# Altium schematic sheet 06 MIMXRT1170 PART2.SchDoc
size A2; VersionControl_RevNumber: DNP; IsUserConfigurable: DNP; OrgAddr3: Sunrise FL 33323; OrgName: Pixels on Target; Page Create Date: March  8, 1995; Page Number: 5; Page Size: A2; Page Count: 14; OrgAddr2: Suite #104; RevCode: A; Doc: SCH30-00070-00; DsnPath: C:\Users\Carter Nichols\Documents\BitBucket boards (Cadence)\30-00070-00_Original\SCH30-00070-00.DSN; SchematicName: SC30-00070-00; PageName: 05-POWER IN; PageSize: A2; TopSchematic: True; Address4: United States
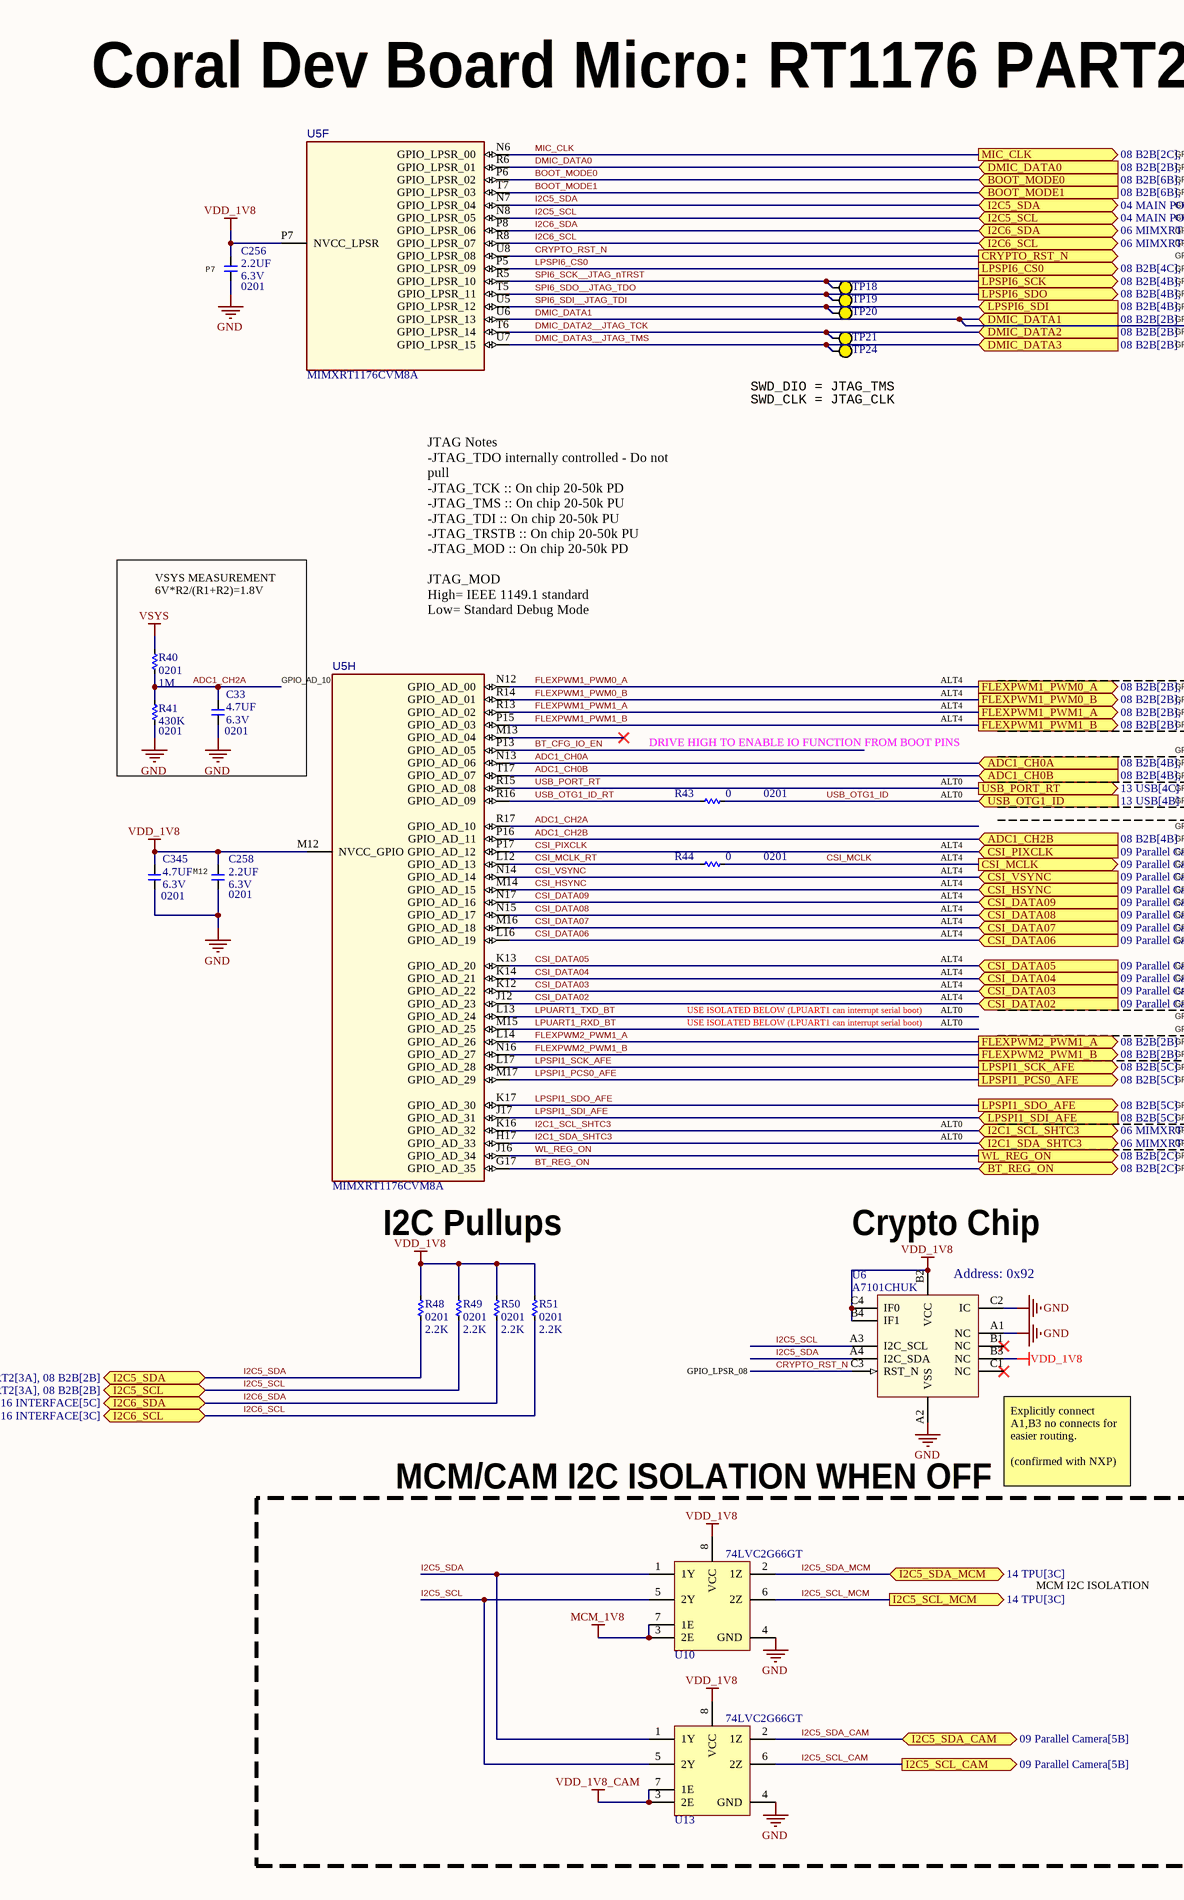
[diagram p0: 06 MIMXRT1170 PART2.SchDoc, left]
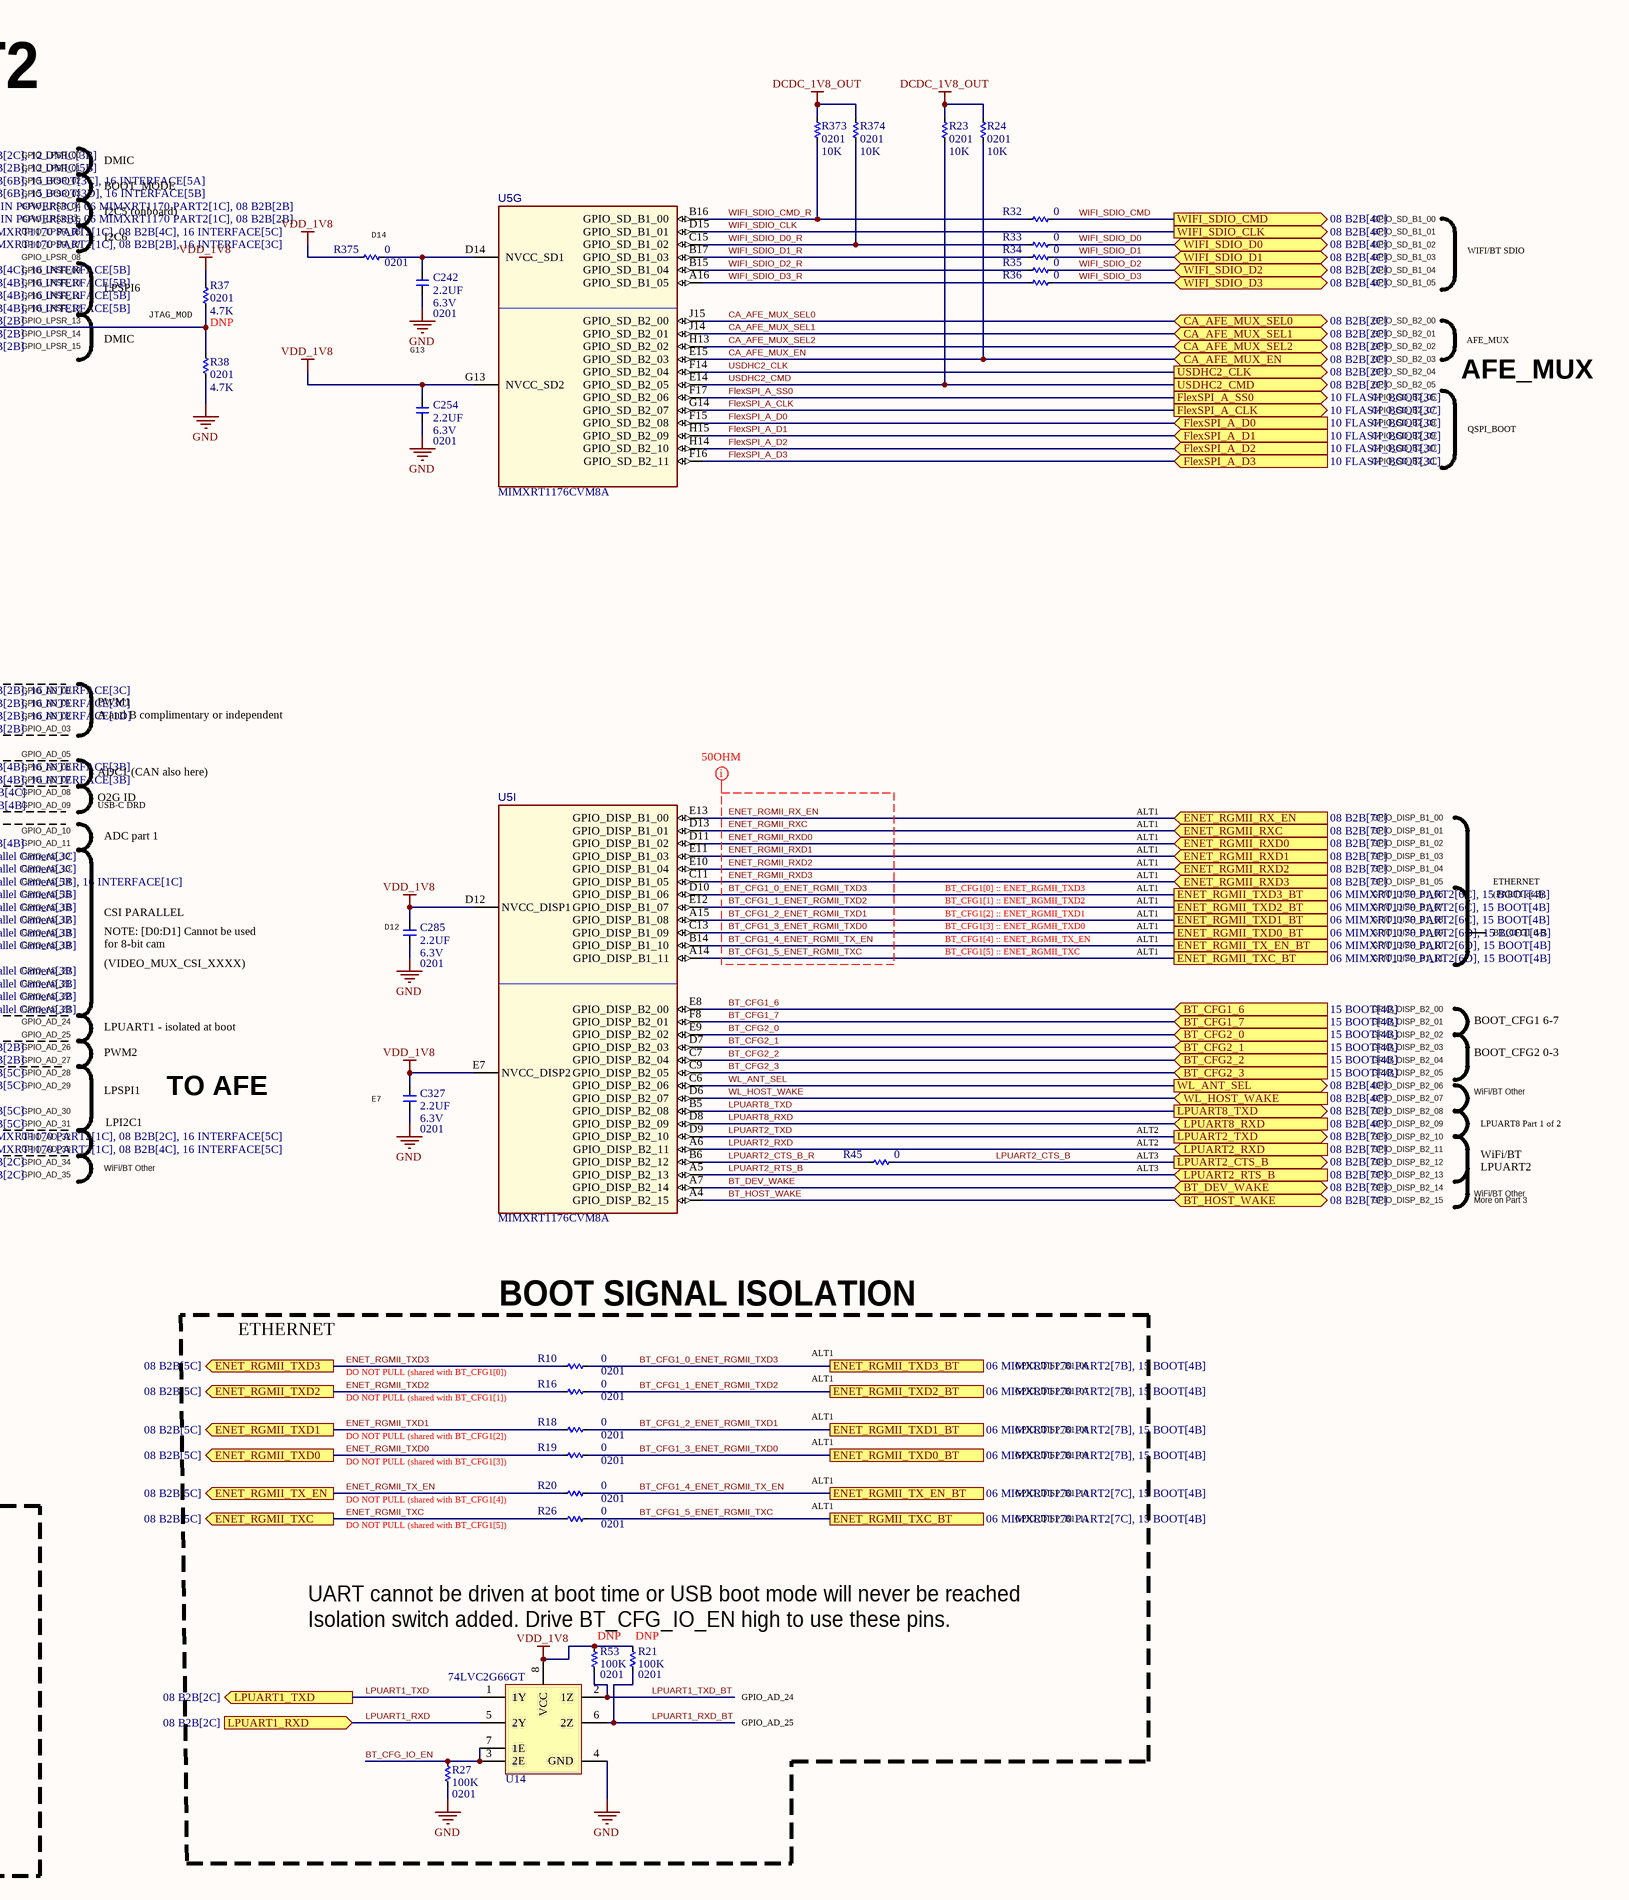
[diagram p1: 06 MIMXRT1170 PART2.SchDoc, right]

## Parts
C33  value 4.7UF  Package: 0201  Voltage: 6.3V  [C0201Y]  (hidden comment: __Template_Cap)
C242  value 2.2UF  Package: 0201  Voltage: 6.3V  [C0201_H0.39MM]  (hidden comment: __Template_Cap)
C254  value 2.2UF  Package: 0201  Voltage: 6.3V  [C0201_H0.39MM]  (hidden comment: __Template_Cap)
C256  value 2.2UF  Package: 0201  Voltage: 6.3V  [C0201_H0.39MM]  (hidden comment: __Template_Cap)
C258  value 2.2UF  Package: 0201  Voltage: 6.3V  [C0201_H0.39MM]  (hidden comment: __Template_Cap)
C285  value 2.2UF  Package: 0201  Voltage: 6.3V  [C0201_H0.39MM]  (hidden comment: __Template_Cap)
C327  value 2.2UF  Package: 0201  Voltage: 6.3V  [C0201_H0.39MM]  (hidden comment: __Template_Cap)
C345  value 4.7UF  Package: 0201  Voltage: 6.3V  [C0201Y]  (hidden comment: __Template_Cap)
R10  value 0  Package: 0201  [R0201]
R16  value 0  Package: 0201  [R0201]
R18  value 0  Package: 0201  [R0201]
R19  value 0  Package: 0201  [R0201]
R20  value 0  Package: 0201  [R0201]
R21  value 100K  Package: 0201  [R0201]
R23  value 10K  Package: 0201  [R0201]
R24  value 10K  Package: 0201  [R0201]
R26  value 0  Package: 0201  [R0201]
R27  value 100K  Package: 0201  [R0201]
R32  value 0  [R0201]
R33  value 0  [R0201]
R34  value 0  [R0201]
R35  value 0  [R0201]
R36  value 0  [R0201]
R37  value 4.7K  Package: 0201  [R0201]
R38  value 4.7K  Package: 0201  [R0201]
R40  value 1M  Package: 0201  [R0201]
R41  value 430K  Package: 0201  [R0201]
R43  value 0  Package: 0201  [R0201]
R44  value 0  Package: 0201  [R0201]
R45  value 0  [R0201]
R48  value 2.2K  Package: 0201  [R0201]
R49  value 2.2K  Package: 0201  [R0201]
R50  value 2.2K  Package: 0201  [R0201]
R51  value 2.2K  Package: 0201  [R0201]
R53  value 100K  Package: 0201  [R0201]
R373  value 10K  Package: 0201  [R0201]
R374  value 10K  Package: 0201  [R0201]
R375  value 0  Package: 0201  [R0201]
TP18  TESTPAD_30MIL  [TESTPAD_SMT_30MIL]  (value not drawn)  (no BOM)
TP19  TESTPAD_30MIL  [TESTPAD_SMT_30MIL]  (value not drawn)  (no BOM)
TP20  TESTPAD_30MIL  [TESTPAD_SMT_30MIL]  (value not drawn)  (no BOM)
TP21  TESTPAD_30MIL  [TESTPAD_SMT_30MIL]  (value not drawn)  (no BOM)
TP24  TESTPAD_30MIL  [TESTPAD_SMT_30MIL]  (value not drawn)  (no BOM)
U5  MFG P/N: MIMXRT1176CVM8A  [BGA289C80P17X17_1400X14000X152]  (hidden comment: MCU_MIMXRT1176CVM8A)  (parts F,G,H,I of 12)
U6  MFG P/N: A7101CHUK  [BGA12C50+3X4_206X202X65]  (hidden comment: SECUR_AUTH_A7101CHUK)
U10  74LVC2G66GT  [SON8_0P5_1L95x1W]
U13  74LVC2G66GT  [SON8_0P5_1L95x1W]
U14  74LVC2G66GT  [SON8_0P5_1L95x1W]

## Blocks framed on the sheet
BOOT SIGNAL ISOLATION: R10 R16 R18-R21 R26 R27 R53 U14
MCM/CAM I2C ISOLATION WHEN OFF: U10 U13

## Ports
ADC1_CH0A (in, see 08 B2B[4B], 16 INTERFACE[3B]), ADC1_CH0B (in, see 08 B2B[4B], 16 INTERFACE[3B]), ADC1_CH2B (in, see 08 B2B[4B]), BOOT_MODE0 (in, see 08 B2B[6B], 15 BOOT[3C], 16 INTERFACE[5A]), BOOT_MODE1 (in, see 08 B2B[6B], 15 BOOT[3D], 16 INTERFACE[5B]), BT_CFG1_6 (in, see 15 BOOT[4B]), BT_CFG1_7 (in, see 15 BOOT[4B]), BT_CFG2_0 (in, see 15 BOOT[4B]), BT_CFG2_1 (in, see 15 BOOT[4B]), BT_CFG2_2 (in, see 15 BOOT[4B]), BT_CFG2_3 (in, see 15 BOOT[4B]), BT_DEV_WAKE (bidir, see 08 B2B[7C]), BT_HOST_WAKE (bidir, see 08 B2B[7C]), BT_REG_ON (bidir, see 08 B2B[2C]), CA_AFE_MUX_EN (bidir, see 08 B2B[2C]), CA_AFE_MUX_SEL0 (bidir, see 08 B2B[2C]), CA_AFE_MUX_SEL1 (bidir, see 08 B2B[2C]), CA_AFE_MUX_SEL2 (bidir, see 08 B2B[2C]), CRYPTO_RST_N (out), CSI_DATA02 (in, see 09 Parallel Camera[3B]), CSI_DATA03 (in, see 09 Parallel Camera[3B]), CSI_DATA04 (in, see 09 Parallel Camera[3B]), CSI_DATA05 (in, see 09 Parallel Camera[3B]), CSI_DATA06 (in, see 09 Parallel Camera[3B]), CSI_DATA07 (in, see 09 Parallel Camera[3B]), CSI_DATA08 (in, see 09 Parallel Camera[3B]), CSI_DATA09 (in, see 09 Parallel Camera[3B]), CSI_HSYNC (in, see 09 Parallel Camera[5B]), CSI_MCLK (out, see 09 Parallel Camera[3C]), CSI_PIXCLK (in, see 09 Parallel Camera[3C]), CSI_VSYNC (in, see 09 Parallel Camera[5B], 16 INTERFACE[1C]), DMIC_DATA0 (in, see 08 B2B[2B], 12 DMIC[5B]), DMIC_DATA1 (in, see 08 B2B[2B]), DMIC_DATA2 (in, see 08 B2B[2B]), DMIC_DATA3 (in, see 08 B2B[2B]), ENET_RGMII_RX_EN (in, see 08 B2B[7C]), ENET_RGMII_RXC (in, see 08 B2B[7C]), ENET_RGMII_RXD0 (in, see 08 B2B[7C]), ENET_RGMII_RXD1 (in, see 08 B2B[7C]), ENET_RGMII_RXD2 (in, see 08 B2B[7C]), ENET_RGMII_RXD3 (in, see 08 B2B[7C]), ENET_RGMII_TX_EN (out, see 08 B2B[5C]), ENET_RGMII_TX_EN_BT (see 06 MIMXRT1170 PART2[6D], 15 BOOT[4B]), ENET_RGMII_TX_EN_BT (see 06 MIMXRT1170 PART2[7C], 15 BOOT[4B]), ENET_RGMII_TXC (out, see 08 B2B[5C]), ENET_RGMII_TXC_BT (see 06 MIMXRT1170 PART2[6D], 15 BOOT[4B]), ENET_RGMII_TXC_BT (see 06 MIMXRT1170 PART2[7C], 15 BOOT[4B]), ENET_RGMII_TXD0 (out, see 08 B2B[5C]), ENET_RGMII_TXD0_BT (see 06 MIMXRT1170 PART2[6D], 15 BOOT[4B]), ENET_RGMII_TXD0_BT (see 06 MIMXRT1170 PART2[7B], 15 BOOT[4B]), ENET_RGMII_TXD1 (out, see 08 B2B[5C]), ENET_RGMII_TXD1_BT (see 06 MIMXRT1170 PART2[6C], 15 BOOT[4B]), ENET_RGMII_TXD1_BT (see 06 MIMXRT1170 PART2[7B], 15 BOOT[4B]), ENET_RGMII_TXD2 (out, see 08 B2B[5C]), ENET_RGMII_TXD2_BT (see 06 MIMXRT1170 PART2[6C], 15 BOOT[4B]), ENET_RGMII_TXD2_BT (see 06 MIMXRT1170 PART2[7B], 15 BOOT[4B]), ENET_RGMII_TXD3 (out, see 08 B2B[5C]), ENET_RGMII_TXD3_BT (see 06 MIMXRT1170 PART2[6C], 15 BOOT[4B]), ENET_RGMII_TXD3_BT (see 06 MIMXRT1170 PART2[7B], 15 BOOT[4B]), FLEXPWM1_PWM0_A (out, see 08 B2B[2B], 16 INTERFACE[3C]), FLEXPWM1_PWM0_B (out, see 08 B2B[2B], 16 INTERFACE[3C]), FLEXPWM1_PWM1_A (out, see 08 B2B[2B], 16 INTERFACE[1D]), FLEXPWM1_PWM1_B (out, see 08 B2B[2B]), FLEXPWM2_PWM1_A (out, see 08 B2B[2B]), FLEXPWM2_PWM1_B (out, see 08 B2B[2B]), FlexSPI_A_CLK (out, see 10 FLASH_BOOT[3C]), FlexSPI_A_D0 (in, see 10 FLASH_BOOT[3C]), FlexSPI_A_D1 (in, see 10 FLASH_BOOT[3C]), FlexSPI_A_D2 (in, see 10 FLASH_BOOT[3C]), FlexSPI_A_D3 (in, see 10 FLASH_BOOT[3C]), FlexSPI_A_SS0 (out, see 10 FLASH_BOOT[3C]), I2C1_SCL_SHTC3 (bidir, see 06 MIMXRT1170 PART2[1C], 08 B2B[2C], 16 INTERFACE[5C]), I2C1_SDA_SHTC3 (bidir, see 06 MIMXRT1170 PART2[1C], 08 B2B[4C], 16 INTERFACE[5C]), I2C5_SCL (bidir, see 04 MAIN POWER[3B], 06 MIMXRT1170 PART2[1C], 08 B2B[2B]), I2C5_SCL (bidir, see 04 MAIN POWER[3B], 06 MIMXRT1170 PART2[3A], 08 B2B[2B]), I2C5_SCL_CAM (out, see 09 Parallel Camera[5B]), I2C5_SCL_MCM (out, see 14 TPU[3C]), I2C5_SDA (bidir, see 04 MAIN POWER[3C], 06 MIMXRT1170 PART2[1C], 08 B2B[2B]), I2C5_SDA (bidir, see 04 MAIN POWER[3C], 06 MIMXRT1170 PART2[3A], 08 B2B[2B]), I2C5_SDA_CAM (bidir, see 09 Parallel Camera[5B]), I2C5_SDA_MCM (bidir, see 14 TPU[3C]), I2C6_SCL (bidir, see 06 MIMXRT1170 PART2[1C], 08 B2B[2B], 16 INTERFACE[3C]), I2C6_SCL (bidir, see 06 MIMXRT1170 PART2[3A], 08 B2B[2B], 16 INTERFACE[3C]), I2C6_SDA (bidir, see 06 MIMXRT1170 PART2[1C], 08 B2B[4C], 16 INTERFACE[5C]), I2C6_SDA (bidir, see 06 MIMXRT1170 PART2[3A], 08 B2B[4C], 16 INTERFACE[5C]), LPSPI1_PCS0_AFE (out, see 08 B2B[5C]), LPSPI1_SCK_AFE (out, see 08 B2B[5C]), LPSPI1_SDI_AFE (in, see 08 B2B[5C]), LPSPI1_SDO_AFE (out, see 08 B2B[5C]), LPSPI6_CS0 (out, see 08 B2B[4C], 16 INTERFACE[5B]), LPSPI6_SCK (out, see 08 B2B[4B], 16 INTERFACE[5B]), LPSPI6_SDI (in, see 08 B2B[4B], 16 INTERFACE[5B]), LPSPI6_SDO (out, see 08 B2B[4B], 16 INTERFACE[5B]), LPUART1_RXD (in, see 08 B2B[2C]), LPUART1_TXD (out, see 08 B2B[2C]), LPUART2_CTS_B (out, see 08 B2B[7C]), LPUART2_RTS_B (in, see 08 B2B[7C]), LPUART2_RXD (in, see 08 B2B[7C]), LPUART2_TXD (out, see 08 B2B[7C]), LPUART8_RXD (in, see 08 B2B[4C]), LPUART8_TXD (out, see 08 B2B[7C]), MIC_CLK (out, see 08 B2B[2C], 12 DMIC[3B]), USB_OTG1_ID (in, see 13 USB[4B]), USB_PORT_RT (out, see 13 USB[4C]), USDHC2_CLK (out, see 08 B2B[2C]), USDHC2_CMD (out, see 08 B2B[2C]), WIFI_SDIO_CLK (out, see 08 B2B[4C]), WIFI_SDIO_CMD (out, see 08 B2B[4C]), WIFI_SDIO_D0 (bidir, see 08 B2B[4C]), WIFI_SDIO_D1 (bidir, see 08 B2B[4C]), WIFI_SDIO_D2 (bidir, see 08 B2B[2C]), WIFI_SDIO_D3 (bidir, see 08 B2B[4C]), WL_ANT_SEL (out, see 08 B2B[4C]), WL_HOST_WAKE (in, see 08 B2B[4C]), WL_REG_ON (out, see 08 B2B[2C])

## Nets
DCDC_1V8_OUT: R23.2 R24.2 R373.2 R374.2
GND: C33.2 C242.2 C254.2 C256.2 C258.2 C285.2 C327.2 C345.2 R27.1 R38.1 R41.1 U6.A1(NC) U6.A2(VSS) U6.C2(IC) U10.4(GND) U13.4(GND) U14.4(GND)
MCM_1V8: U10.3(2E) U10.7(1E)
VDD_1V8: C254.1 C256.1 C258.1 C285.1 C327.1 C345.1 R21.2 R37.2 R48.2 R49.2 R50.2 R51.2 R53.2 R375.1 U5.D12(NVCC_DISP1) U5.E7(NVCC_DISP2) U5.G13(NVCC_SD2) U5.M12(NVCC_GPIO) U5.P7(NVCC_LPSR) U6.B2(VCC) U6.B3(NC) U6.B4(IF1) U6.C4(IF0) U10.8(VCC) U13.8(VCC) U14.8(VCC)
VDD_1V8_CAM: U13.3(2E) U13.7(1E)
VSYS: R40.2
ADC1_CH0A: U5.N13(GPIO_AD_06) ; port ADC1_CH0A
ADC1_CH0B: U5.T17(GPIO_AD_07) ; port ADC1_CH0B
ADC1_CH2A: C33.1 R40.1 R41.2 U5.R17(GPIO_AD_10)
ADC1_CH2B: U5.P16(GPIO_AD_11) ; port ADC1_CH2B
BOOT_MODE0: U5.P6(GPIO_LPSR_02) ; port BOOT_MODE0
BOOT_MODE1: U5.T7(GPIO_LPSR_03) ; port BOOT_MODE1
BT_CFG1_0_ENET_RGMII_TXD3: R10.2 U5.D10(GPIO_DISP_B1_06) ; port ENET_RGMII_TXD3_BT
BT_CFG1_1_ENET_RGMII_TXD2: R16.2 U5.E12(GPIO_DISP_B1_07) ; port ENET_RGMII_TXD2_BT
BT_CFG1_2_ENET_RGMII_TXD1: R18.2 U5.A15(GPIO_DISP_B1_08) ; port ENET_RGMII_TXD1_BT
BT_CFG1_3_ENET_RGMII_TXD0: R19.2 U5.C13(GPIO_DISP_B1_09) ; port ENET_RGMII_TXD0_BT
BT_CFG1_4_ENET_RGMII_TX_EN: R20.2 U5.B14(GPIO_DISP_B1_10) ; port ENET_RGMII_TX_EN_BT
BT_CFG1_5_ENET_RGMII_TXC: R26.2 U5.A14(GPIO_DISP_B1_11) ; port ENET_RGMII_TXC_BT
BT_CFG1_6: U5.E8(GPIO_DISP_B2_00) ; port BT_CFG1_6
BT_CFG1_7: U5.F8(GPIO_DISP_B2_01) ; port BT_CFG1_7
BT_CFG2_0: U5.E9(GPIO_DISP_B2_02) ; port BT_CFG2_0
BT_CFG2_1: U5.D7(GPIO_DISP_B2_03) ; port BT_CFG2_1
BT_CFG2_2: U5.C7(GPIO_DISP_B2_04) ; port BT_CFG2_2
BT_CFG2_3: U5.C9(GPIO_DISP_B2_05) ; port BT_CFG2_3
BT_CFG_IO_EN: R27.2 U5.P13(GPIO_AD_05) U14.3(2E) U14.7(1E)
BT_DEV_WAKE: U5.A7(GPIO_DISP_B2_14) ; port BT_DEV_WAKE
BT_HOST_WAKE: U5.A4(GPIO_DISP_B2_15) ; port BT_HOST_WAKE
BT_REG_ON: U5.G17(GPIO_AD_35) ; port BT_REG_ON
CA_AFE_MUX_EN: R24.1 U5.E15(GPIO_SD_B2_03) ; port CA_AFE_MUX_EN
CA_AFE_MUX_SEL0: U5.J15(GPIO_SD_B2_00) ; port CA_AFE_MUX_SEL0
CA_AFE_MUX_SEL1: U5.J14(GPIO_SD_B2_01) ; port CA_AFE_MUX_SEL1
CA_AFE_MUX_SEL2: U5.H13(GPIO_SD_B2_02) ; port CA_AFE_MUX_SEL2
CRYPTO_RST_N: U5.U8(GPIO_LPSR_08) U6.C3(RST_N) ; port CRYPTO_RST_N
CSI_DATA02: U5.J12(GPIO_AD_23) ; port CSI_DATA02
CSI_DATA03: U5.K12(GPIO_AD_22) ; port CSI_DATA03
CSI_DATA04: U5.K14(GPIO_AD_21) ; port CSI_DATA04
CSI_DATA05: U5.K13(GPIO_AD_20) ; port CSI_DATA05
CSI_DATA06: U5.L16(GPIO_AD_19) ; port CSI_DATA06
CSI_DATA07: U5.M16(GPIO_AD_18) ; port CSI_DATA07
CSI_DATA08: U5.N15(GPIO_AD_17) ; port CSI_DATA08
CSI_DATA09: U5.N17(GPIO_AD_16) ; port CSI_DATA09
CSI_HSYNC: U5.M14(GPIO_AD_15) ; port CSI_HSYNC
CSI_MCLK: R44.2 ; port CSI_MCLK
CSI_MCLK_RT: R44.1 U5.L12(GPIO_AD_13)
CSI_PIXCLK: U5.P17(GPIO_AD_12) ; port CSI_PIXCLK
CSI_VSYNC: U5.N14(GPIO_AD_14) ; port CSI_VSYNC
DMIC_DATA0: U5.R6(GPIO_LPSR_01) ; port DMIC_DATA0
DMIC_DATA1: R37.1 R38.2 U5.U6(GPIO_LPSR_13) ; port DMIC_DATA1
DMIC_DATA2__JTAG_TCK: TP21.1 U5.T6(GPIO_LPSR_14) ; port DMIC_DATA2
DMIC_DATA3__JTAG_TMS: TP24.1 U5.U7(GPIO_LPSR_15) ; port DMIC_DATA3
ENET_RGMII_RX_EN: U5.E13(GPIO_DISP_B1_00) ; port ENET_RGMII_RX_EN
ENET_RGMII_RXC: U5.D13(GPIO_DISP_B1_01) ; port ENET_RGMII_RXC
ENET_RGMII_RXD0: U5.D11(GPIO_DISP_B1_02) ; port ENET_RGMII_RXD0
ENET_RGMII_RXD1: U5.E11(GPIO_DISP_B1_03) ; port ENET_RGMII_RXD1
ENET_RGMII_RXD2: U5.E10(GPIO_DISP_B1_04) ; port ENET_RGMII_RXD2
ENET_RGMII_RXD3: U5.C11(GPIO_DISP_B1_05) ; port ENET_RGMII_RXD3
ENET_RGMII_TX_EN: R20.1 ; port ENET_RGMII_TX_EN
ENET_RGMII_TXC: R26.1 ; port ENET_RGMII_TXC
ENET_RGMII_TXD0: R19.1 ; port ENET_RGMII_TXD0
ENET_RGMII_TXD1: R18.1 ; port ENET_RGMII_TXD1
ENET_RGMII_TXD2: R16.1 ; port ENET_RGMII_TXD2
ENET_RGMII_TXD3: R10.1 ; port ENET_RGMII_TXD3
FLEXPWM1_PWM0_A: U5.N12(GPIO_AD_00) ; port FLEXPWM1_PWM0_A
FLEXPWM1_PWM0_B: U5.R14(GPIO_AD_01) ; port FLEXPWM1_PWM0_B
FLEXPWM1_PWM1_A: U5.R13(GPIO_AD_02) ; port FLEXPWM1_PWM1_A
FLEXPWM1_PWM1_B: U5.P15(GPIO_AD_03) ; port FLEXPWM1_PWM1_B
FLEXPWM2_PWM1_A: U5.L14(GPIO_AD_26) ; port FLEXPWM2_PWM1_A
FLEXPWM2_PWM1_B: U5.N16(GPIO_AD_27) ; port FLEXPWM2_PWM1_B
FlexSPI_A_CLK: U5.G14(GPIO_SD_B2_07) ; port FlexSPI_A_CLK
FlexSPI_A_D0: U5.F15(GPIO_SD_B2_08) ; port FlexSPI_A_D0
FlexSPI_A_D1: U5.H15(GPIO_SD_B2_09) ; port FlexSPI_A_D1
FlexSPI_A_D2: U5.H14(GPIO_SD_B2_10) ; port FlexSPI_A_D2
FlexSPI_A_D3: U5.F16(GPIO_SD_B2_11) ; port FlexSPI_A_D3
FlexSPI_A_SS0: U5.F17(GPIO_SD_B2_06) ; port FlexSPI_A_SS0
I2C1_SCL_SHTC3: U5.K16(GPIO_AD_32) ; port I2C1_SCL_SHTC3
I2C1_SDA_SHTC3: U5.H17(GPIO_AD_33) ; port I2C1_SDA_SHTC3
I2C5_SCL: R49.1 U5.N8(GPIO_LPSR_05) U6.A3(I2C_SCL) U10.5(2Y) U13.5(2Y) ; port I2C5_SCL
I2C5_SCL_CAM: U13.6(2Z) ; port I2C5_SCL_CAM
I2C5_SCL_MCM: U10.6(2Z) ; port I2C5_SCL_MCM
I2C5_SDA: R48.1 U5.N7(GPIO_LPSR_04) U6.A4(I2C_SDA) U10.1(1Y) U13.1(1Y) ; port I2C5_SDA
I2C5_SDA_CAM: U13.2(1Z) ; port I2C5_SDA_CAM
I2C5_SDA_MCM: U10.2(1Z) ; port I2C5_SDA_MCM
I2C6_SCL: R51.1 U5.R8(GPIO_LPSR_07) ; port I2C6_SCL
I2C6_SDA: R50.1 U5.P8(GPIO_LPSR_06) ; port I2C6_SDA
LPSPI1_PCS0_AFE: U5.M17(GPIO_AD_29) ; port LPSPI1_PCS0_AFE
LPSPI1_SCK_AFE: U5.L17(GPIO_AD_28) ; port LPSPI1_SCK_AFE
LPSPI1_SDI_AFE: U5.J17(GPIO_AD_31) ; port LPSPI1_SDI_AFE
LPSPI1_SDO_AFE: U5.K17(GPIO_AD_30) ; port LPSPI1_SDO_AFE
LPSPI6_CS0: U5.P5(GPIO_LPSR_09) ; port LPSPI6_CS0
LPUART1_RXD: U14.5(2Y) ; port LPUART1_RXD
LPUART1_RXD_BT: R21.1 U5.M15(GPIO_AD_25) U14.6(2Z)
LPUART1_TXD: U14.1(1Y) ; port LPUART1_TXD
LPUART1_TXD_BT: R53.1 U5.L13(GPIO_AD_24) U14.2(1Z)
LPUART2_CTS_B: R45.2 ; port LPUART2_CTS_B
LPUART2_CTS_B_R: R45.1 U5.B6(GPIO_DISP_B2_12)
LPUART2_RTS_B: U5.A5(GPIO_DISP_B2_13) ; port LPUART2_RTS_B
LPUART2_RXD: U5.A6(GPIO_DISP_B2_11) ; port LPUART2_RXD
LPUART2_TXD: U5.D9(GPIO_DISP_B2_10) ; port LPUART2_TXD
LPUART8_RXD: U5.D8(GPIO_DISP_B2_09) ; port LPUART8_RXD
LPUART8_TXD: U5.B5(GPIO_DISP_B2_08) ; port LPUART8_TXD
MIC_CLK: U5.N6(GPIO_LPSR_00) ; port MIC_CLK
SPI6_SCK__JTAG_nTRST: TP18.1 U5.R5(GPIO_LPSR_10) ; port LPSPI6_SCK
SPI6_SDI__JTAG_TDI: TP20.1 U5.U5(GPIO_LPSR_12) ; port LPSPI6_SDI
SPI6_SDO__JTAG_TDO: TP19.1 U5.T5(GPIO_LPSR_11) ; port LPSPI6_SDO
USB_OTG1_ID: R43.2 ; port USB_OTG1_ID
USB_OTG1_ID_RT: R43.1 U5.R16(GPIO_AD_09)
USB_PORT_RT: U5.R15(GPIO_AD_08) ; port USB_PORT_RT
USDHC2_CLK: U5.F14(GPIO_SD_B2_04) ; port USDHC2_CLK
USDHC2_CMD: R23.1 U5.E14(GPIO_SD_B2_05) ; port USDHC2_CMD
WIFI_SDIO_CLK: U5.D15(GPIO_SD_B1_01) ; port WIFI_SDIO_CLK
WIFI_SDIO_CMD: R32.2 ; port WIFI_SDIO_CMD
WIFI_SDIO_CMD_R: R32.1 R373.1 U5.B16(GPIO_SD_B1_00)
WIFI_SDIO_D0: R33.2 ; port WIFI_SDIO_D0
WIFI_SDIO_D0_R: R33.1 R374.1 U5.C15(GPIO_SD_B1_02)
WIFI_SDIO_D1: R34.2 ; port WIFI_SDIO_D1
WIFI_SDIO_D1_R: R34.1 U5.B17(GPIO_SD_B1_03)
WIFI_SDIO_D2: R35.2 ; port WIFI_SDIO_D2
WIFI_SDIO_D2_R: R35.1 U5.B15(GPIO_SD_B1_04)
WIFI_SDIO_D3: R36.2 ; port WIFI_SDIO_D3
WIFI_SDIO_D3_R: R36.1 U5.A16(GPIO_SD_B1_05)
WL_ANT_SEL: U5.C6(GPIO_DISP_B2_06) ; port WL_ANT_SEL
WL_HOST_WAKE: U5.D6(GPIO_DISP_B2_07) ; port WL_HOST_WAKE
WL_REG_ON: U5.J16(GPIO_AD_34) ; port WL_REG_ON
NetC242_1: C242.1 R375.2 U5.D14(NVCC_SD1)

Not connected (* = marked no-connect by the designer): U5 M13(GPIO_AD_04)*; U6 B1(NC)* C1(NC)*

## Layout directives
net class 50OHM: BT_CFG1_0_ENET_RGMII_TXD3, BT_CFG1_1_ENET_RGMII_TXD2, BT_CFG1_2_ENET_RGMII_TXD1, BT_CFG1_3_ENET_RGMII_TXD0, BT_CFG1_4_ENET_RGMII_TX_EN, BT_CFG1_5_ENET_RGMII_TXC, ENET_RGMII_RX_EN, ENET_RGMII_RXC, ENET_RGMII_RXD0, ENET_RGMII_RXD1, ENET_RGMII_RXD2, ENET_RGMII_RXD3

## Notes on the sheet
- Coral Dev Board Micro: RT1176 PART2
- GPIO_LPSR_00
- GPIO_LPSR_01
- GPIO_LPSR_02
- DMIC
- GPIO_LPSR_03
- GPIO_LPSR_04
- GPIO_LPSR_05
- GPIO_LPSR_06
- I2C5 (onboard)
- I2C6
- BOOT_MODE
- (near R375) D14
- GPIO_SD_B1_00
- GPIO_SD_B1_01
- (near C256) P7
- GPIO_LPSR_07
- GPIO_LPSR_08
- GPIO_LPSR_09
- GPIO_LPSR_10
- GPIO_LPSR_11
- GPIO_LPSR_12
- LPSPI6
- GPIO_SD_B1_02
- GPIO_SD_B1_03
- GPIO_SD_B1_04
- GPIO_SD_B1_05
- WIFI/BT SDIO
- GPIO_LPSR_13
- GPIO_LPSR_14
- GPIO_LPSR_15
- (near R37) JTAG_MOD
- G13
- GPIO_SD_B2_00
- GPIO_SD_B2_01
- GPIO_SD_B2_02
- GPIO_SD_B2_03
- AFE_MUX
- SWD_DIO = JTAG_TMS
- SWD_CLK = JTAG_CLK
- GPIO_SD_B2_04
- GPIO_SD_B2_05
- GPIO_SD_B2_06
- GPIO_SD_B2_07
- GPIO_SD_B2_08
- GPIO_SD_B2_09
- QSPI_BOOT
- GPIO_SD_B2_10
- GPIO_SD_B2_11
- VSYS MEASUREMENT
- 6V*R2/(R1+R2)=1.8V
- (near U5) GPIO_AD_10
- (near U5) JTAG Notes
  -JTAG_TDO internally controlled - Do not pull
  -JTAG_TCK	:: On chip 20-50k PD
  -JTAG_TMS	:: On chip 20-50k PU
  -JTAG_TDI	:: On chip 20-50k PU
  -JTAG_TRSTB	:: On chip 20-50k PU
  -JTAG_MOD	:: On chip 20-50k PD
  JTAG_MOD
  High= IEEE 1149.1 standard
  Low= Standard Debug Mode
- ALT4
- GPIO_AD_00
- DRIVE HIGH TO ENABLE IO FUNCTION FROM BOOT PINS
- GPIO_AD_01
- GPIO_AD_02
- GPIO_AD_03
- PWM1
- A and B complimentary or independent
- ALT0
- GPIO_AD_05
- GPIO_AD_06
- GPIO_AD_07
- GPIO_AD_08
- GPIO_AD_09
- USB-C DRD
- ADC1 (CAN also here)
- O2G ID
- ALT1
- GPIO_DISP_B1_00
- (near C258) M12
- GPIO_AD_10
- GPIO_AD_11
- GPIO_AD_12
- GPIO_AD_13
- ADC part 1
- GPIO_DISP_B1_01
- GPIO_DISP_B1_02
- GPIO_DISP_B1_03
- GPIO_DISP_B1_04
- GPIO_AD_14
- GPIO_AD_15
- GPIO_AD_16
- GPIO_AD_17
- GPIO_AD_18
- GPIO_AD_19
- CSI PARALLEL
- NOTE: [D0:D1] Cannot be used
- for 8-bit cam
- (near C285) D12
- BT_CFG1[0] :: ENET_RGMII_TXD3
- BT_CFG1[1] :: ENET_RGMII_TXD2
- BT_CFG1[2] :: ENET_RGMII_TXD1
- BT_CFG1[3] :: ENET_RGMII_TXD0
- BT_CFG1[4] :: ENET_RGMII_TX_EN
- GPIO_DISP_B1_05
- GPIO_DISP_B1_06
- GPIO_DISP_B1_07
- GPIO_DISP_B1_08
- GPIO_DISP_B1_09
- GPIO_DISP_B1_10
- ETHERNET
- (PART1 of 3)
- BT_CFG1 0-5
- GPIO_AD_20
- GPIO_AD_21
- GPIO_AD_22
- (VIDEO_MUX_CSI_XXXX)
- BT_CFG1[5] :: ENET_RGMII_TXC
- GPIO_DISP_B1_11
- USE ISOLATED BELOW (LPUART1 can interrupt serial boot)
- GPIO_AD_23
- GPIO_AD_24
- GPIO_AD_25
- GPIO_AD_26
- GPIO_AD_27
- GPIO_AD_28
- LPUART1 - isolated at boot
- PWM2
- GPIO_DISP_B2_00
- GPIO_DISP_B2_01
- GPIO_DISP_B2_02
- GPIO_DISP_B2_03
- GPIO_DISP_B2_04
- GPIO_DISP_B2_05
- BOOT_CFG2 0-3
- BOOT_CFG1 6-7
- GPIO_AD_29
- GPIO_AD_30
- GPIO_AD_31
- LPSPI1
- LPI2C1
- TO SHTC3
- TO AFE
- (near C327) E7
- ALT2
- GPIO_DISP_B2_07
- GPIO_DISP_B2_08
- GPIO_DISP_B2_09
- GPIO_DISP_B2_06
- WiFi/BT Other
- LPUART8 Part 1 of 2
- GPIO_AD_32
- GPIO_AD_33
- GPIO_AD_34
- GPIO_AD_35
- ALT3
- GPIO_DISP_B2_10
- GPIO_DISP_B2_11
- GPIO_DISP_B2_12
- GPIO_DISP_B2_13
- GPIO_DISP_B2_14
- GPIO_DISP_B2_15
- More on Part 3
- WiFi/BT
- LPUART2
- I2C Pullups
- Crypto Chip
- (near U6) Address: 0x92
- DO NOT PULL (shared with BT_CFG1[0])
- DO NOT PULL (shared with BT_CFG1[1])
- DO NOT PULL (shared with BT_CFG1[2])
- (near U6) Explicitly connect A1,B3 no connects for easier routing.
  (confirmed with NXP)
- DO NOT PULL (shared with BT_CFG1[3])
- DO NOT PULL (shared with BT_CFG1[4])
- DO NOT PULL (shared with BT_CFG1[5])
- MCM I2C ISOLATION
- UART cannot be driven at boot time or USB boot mode will never be reached
- Isolation switch added. Drive BT_CFG_IO_EN high to use these pins.
- Title
- Size:
- Date:
- File:
- A2
- Number:
- Time:
- Revision:
- Sheet
- of

## Library data of the parts
C33 C345 = 1199: CAP, CER, X5R, 4.7uF, 20%, 6.3V, 0201; ID: 1199; MFG: MURATA; MFG P/N: GRM035R60J475ME15D; XPN: 150-01224-00; PROXY: 150-03477-00; Status: Released; Dielectric: X5R; Tolerance: 20%; Height: 0.33mm T; ComponentLink1Description: Datasheet; COMMON: 150-01224-00; LOON: 150-01224-00; Gecko: 150-01224-00
C242 C254 C256 C258 C285 C327 = 1761: CAP, CER, X5R, 2.2uF, 20%, 6.3V, 0201, 0.39mm; ID: 1761; MFG: YAGEO; MFG P/N: CC0201MRX5R5BB225; EPIC: G150-01316-00; Status: In Development; Dielectric: X5R; Tolerance: 20%; Height: 0.39mm; Supplier 1: Digi-Key; HelpURL: https://www.digikey.com/product-detail/en/yageo/CC0201MRX5R5BB225/311-3473-1-ND/7164494; ComponentLink1Description: Datasheet; ComponentLink1URL: http://www.yageo.com/documents/recent/UPY-GPHC_X5R_4V-to-50V_25.pdf; Supplier Part Number 1: 311-3473-1-ND
R10 R16 R18-R20 R26 R32-R36 R43-R45 R375 = 8315: RES, 0.0, 1/20W, 0201; ID: 8315; MFG: PANASONIC; MFG P/N: ERJ1GN0R00C; Tolerance: JUMPER; COMMON: 470-00013-00; PROXY: Use ID #6940; Status: Released; Power: 1/20W; LOON: 470-00013-00; Gecko: 470-00013-00; XPN: 470-00013-00
R21 R53 = 6760: RES, 100K, 1%, 1/20W, 0201; ID: 6760; MFG: PANASONIC; MFG P/N: ERJ1GNF1003C; COMMON: 470-00506-00; Status: Released; Power: 1/20W; Tolerance: 1%; LOON: 470-00506-00; Gecko: 470-00506-00; XPN: 470-00506-00; DNP: DNP
R23 R24 R373 R374 = 4151: RES, 10K, 1%, 1/20W, 0201; ID: 4151; MFG: YAGEO; MFG P/N: RC0201FR-0710KL; COMMON: 470-00033-00; PROXY: 470-16076-00; Status: Released; Power: 1/20W; Tolerance: 1%; Height: 0.26mm; Supplier 1: Digi-Key; LOON: 470-00033-00; Gecko: 470-00033-00; XPN: 470-00033-00; Supplier Part Number 1: 311-10.0KMCT-ND
R27 = 7818: RES, 100K, 1%, 1/20W, 0201; ID: 7818; MFG: PANASONIC; MFG P/N: ERJ1GEF1003C; COMMON: 470-00506-00; Status: NRND; Power: 1/20W; Tolerance: 1%; LOON: 470-00506-00; Gecko: 470-00506-00; XPN: 470-00506-00
R37 R38 = 6602: RES, 4.7K, 5%, 1/20W, 0201; ID: 6602; MFG: YAGEO; MFG P/N: RC0201JR-074K7L; COMMON: 470-00012-00; Status: Released; Power: 1/20W; Tolerance: 5%; LOON: 470-00012-00; Gecko: 470-00012-00; XPN: 470-00012-00
  R37: DNP: DNP
R40 = 7806: RES, 1M, 1%, 1/20W, 0201; ID: 7806; MFG: PANASONIC; MFG P/N: ERJ1GEF1004C; COMMON: 470-00029-00; Status: NRND; Power: 1/20W; Tolerance: 1%; LOON: 470-00029-00; Gecko: 470-00029-00; XPN: 470-00029-00
R41 = 5484: Resistor, 430K Ohms, 0201, 0.05W, ±1%; ID: 5484; MFG: PANASONIC; MFG P/N: ERJ-1GEF4303C; Power: 1/20W; COMMON: 470-08715-00; XPN: XS-10019223; Status: NRND; Tolerance: 1%; Height: 0.26mm; Supplier 1: Digi-Key; LOON: 470-08715-00; Gecko: 470-08715-00; Supplier Part Number 1: P430KABCT-ND
R48-R51 = 7086: RES, 2.2K, 5%, 1/20W, 0201; ID: 7086; MFG: YAGEO; MFG P/N: RC0201JR-072K2L; COMMON: 470-00331-00; Status: Released; Power: 1/20W; Tolerance: 5%; XPN: 470-00331-00
TP18-TP21 TP24 = 178: TESTPAD_SMT_30MIL; ID: 178; MFG: _PCB Feature; Status: Released; ComponentLink1URL: _PCB Feature
U5 = 117: IC, PROCESSOR, MIMXRT1176CV, ARM CORTEX-M4/M7, 2MB RAM, SDRAM, WLAN, BGA-289; ID: 117; MFG: NXP Semiconductors; Status: Released; Package: BGA-289; Category: Integrated Circuits (ICs); RoHS Compliant: Yes; ComponentLink1Description: Datasheet; ComponentLink1URL: https://drive.google.com/file/d/1FTzS3WjHycHWpbzAg-R_xAViv5bKJdqv/view; Height: 1.52mm
U6 = 122: IC, MICRO CONTROLLER, A7101, MX51, SECURITY, TEMP, AUTHENTICATION, I2C, WLCSP-12; ID: 122; MFG: NXP USA Inc.; Status: Released; Package: 12-WLCSP (2.06x2.02); Category: Integrated Circuits (ICs); RoHS Compliant: Yes; Supplier 1: Digi-Key; HelpURL: https://www.digikey.com/en/products/detail/nxp-usa-inc/A7101CHUK-T0BC2HAZ/9664256?s=N4IgTCBcDaIIIHYCMAGJBhAEgVQNIgF0BfIA; ComponentLink1Description: Datasheet; ComponentLink1URL: https://www.nxp.com/docs/en/data-sheet/A71CH-SDS.pdf; Height: 0.65mm; Supplier Part Number 1: 568-14698-2-ND
U10 U13 U14 = 74LVC2G66GT: SPST 2x, 1.65V ~ 5.5V, XSON8, 500MHz at 50Ohm; Help URL: https://www.digikey.com/en/products/detail/nexperia-usa-inc/74LVC2G66GT115/1300857